# EAGLE design ecd (EAGLE 7.7.0)
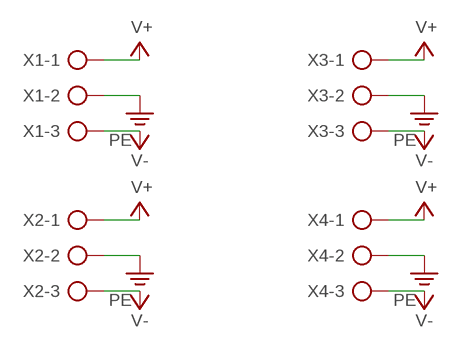
[diagram p0: schematic, sheet 1]

## Parts
X1  AK500/3  [AK500/3]
X2  AK500/3  [AK500/3]
X3  AK500/3  [AK500/3]
X4  AK500/3  [AK500/3]

## Nets
PE: X1.2 X2.2 X3.2 X4.2
V+: X1.1 X2.1 X3.1 X4.1
V-: X1.3 X2.3 X3.3 X4.3

## Library data of the parts
X1-X4 = con-ptr500:AK500/3: CONNECTOR; OC_FARNELL: unknown; OC_NEWARK: unknown

## Board
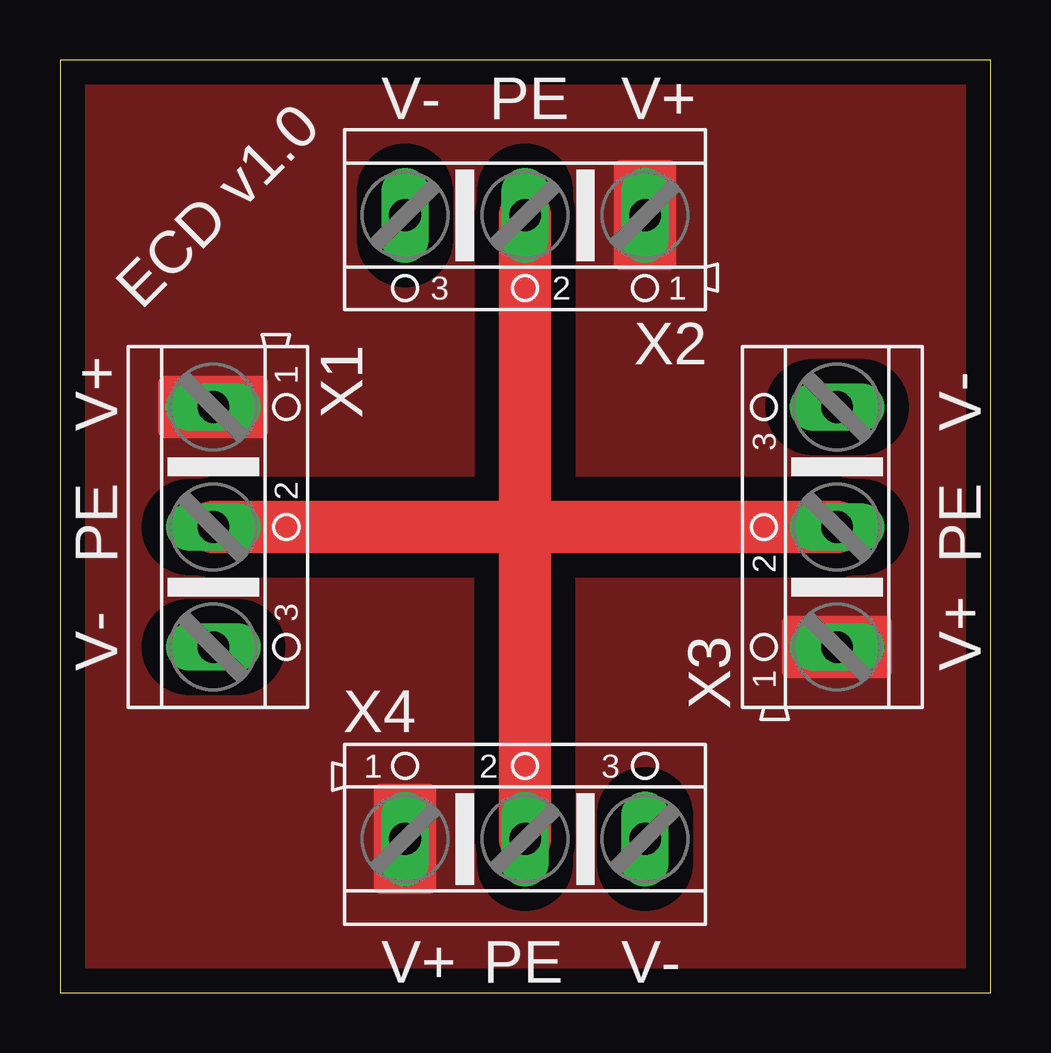
[diagram p1: board, top side]
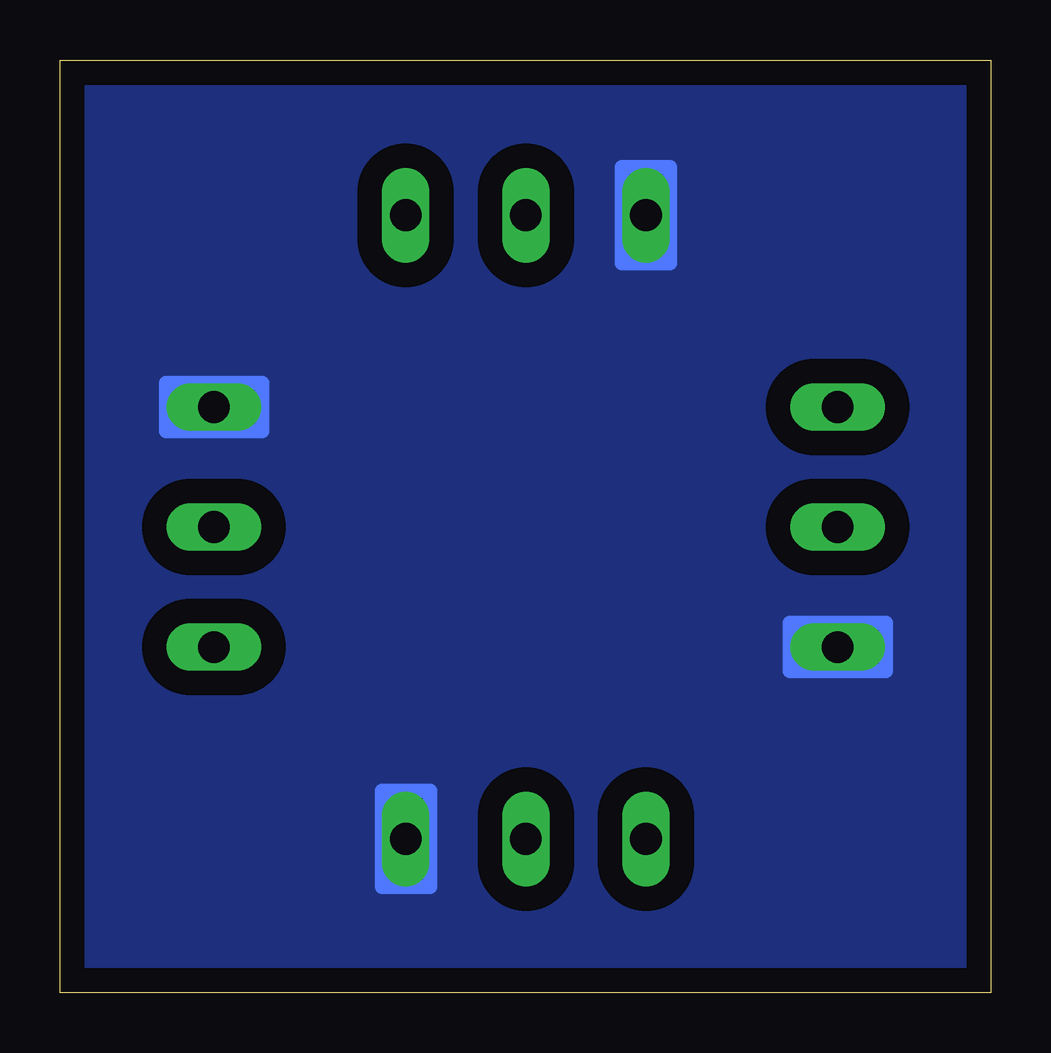
[diagram p2: board, bottom side, seen from below]

Size 38.81 x 38.88 mm. Coordinates in mm from the lower left corner, seen from the top.
Outline: 0,0 38.81,0 38.81,38.88 0,38.88 0,0
Copper layers (1*16): Top 0.035mm / dielectric 1.5mm / Bottom 0.035mm
Design rules "default": minimum track width 10mil, minimum drill 24mil, track to track 8mil, track to pad 8mil, pad to pad 8mil, via to via 8mil, smd to smd 8mil, copper to edge 40mil, drill to drill 8mil, minimum pad ring 10mil, minimum via ring 8mil, stop-mask expansion 4mil, vias tented up to drill 0mil, thermal gap 10mil

### Footprints (pad centres in the part's own frame; a part is rotated, then mirrored left to right if it is on the bottom)
AK500/3 = drill 1.321 long: 1 -5.004,0; 2 0,0; 3 5.004,0

### Placement (x,y rotation side)
X1  6.39,19.41 270 top
X2  19.39,32.41 180 top
X3  32.39,19.41 90 top
X4  19.39,6.41 0 top

### Tracks (layer width: path | path; a pad name or v marks a point on that pad's centre or on a via)
PE
  Top 2.184: X1.2 19.39,19.41 | 19.39,19.41 X3.2 | X2.2 19.39,19.41 | X4.2 19.39,19.41
V+
  Top 0.406: X4.1 15.39,7.41 | X3.1 34.39,14.41 | X2.1 23.39,31.41 | X1.1 8.39,24.41
  Top 0.61: 4.39,25.41 4.39,23.41 8.39,23.41 8.39,24.41 8.39,25.41 4.39,25.41 | 23.39,34.41 25.39,34.41 25.39,30.41 23.39,30.41 23.39,31.41 23.39,34.41 | 30.39,15.41 34.39,15.41 34.39,14.41 34.39,13.41 30.39,13.41 30.39,15.41 | 15.39,8.41 13.39,8.41 13.39,4.41 15.39,4.41 15.39,7.41 15.39,8.41
  pour Top (isolate 1.016): 0.39,38.41 38.39,38.41 38.39,0.41 0.39,0.41
V-
  Bottom 0.406: X1.3 8.39,14.41 8.39,13.41 | X2.3 13.39,31.41 13.39,34.41 | X3.3 34.39,24.41 34.39,25.41 | X4.3 25.39,7.41 25.39,4.41
  Bottom 0.61: 4.39,15.41 4.39,13.41 8.39,13.41 8.39,15.41 4.39,15.41 | 13.39,34.41 13.39,30.41 15.39,30.41 15.39,34.41 13.39,34.41 | 30.39,23.41 34.39,23.41 34.39,25.41 30.39,25.41 30.39,23.41 | 23.39,8.41 23.39,4.41 25.39,4.41 25.39,8.41 23.39,8.41
  pour Bottom (isolate 1.016): 0.39,38.41 38.39,38.41 38.39,0.41 0.39,0.41

### Text on the board
tNames: V- | PE | V+ | ECD v1.0 | V+ | V- | PE | PE | V- | V+ | V+ | PE | V-